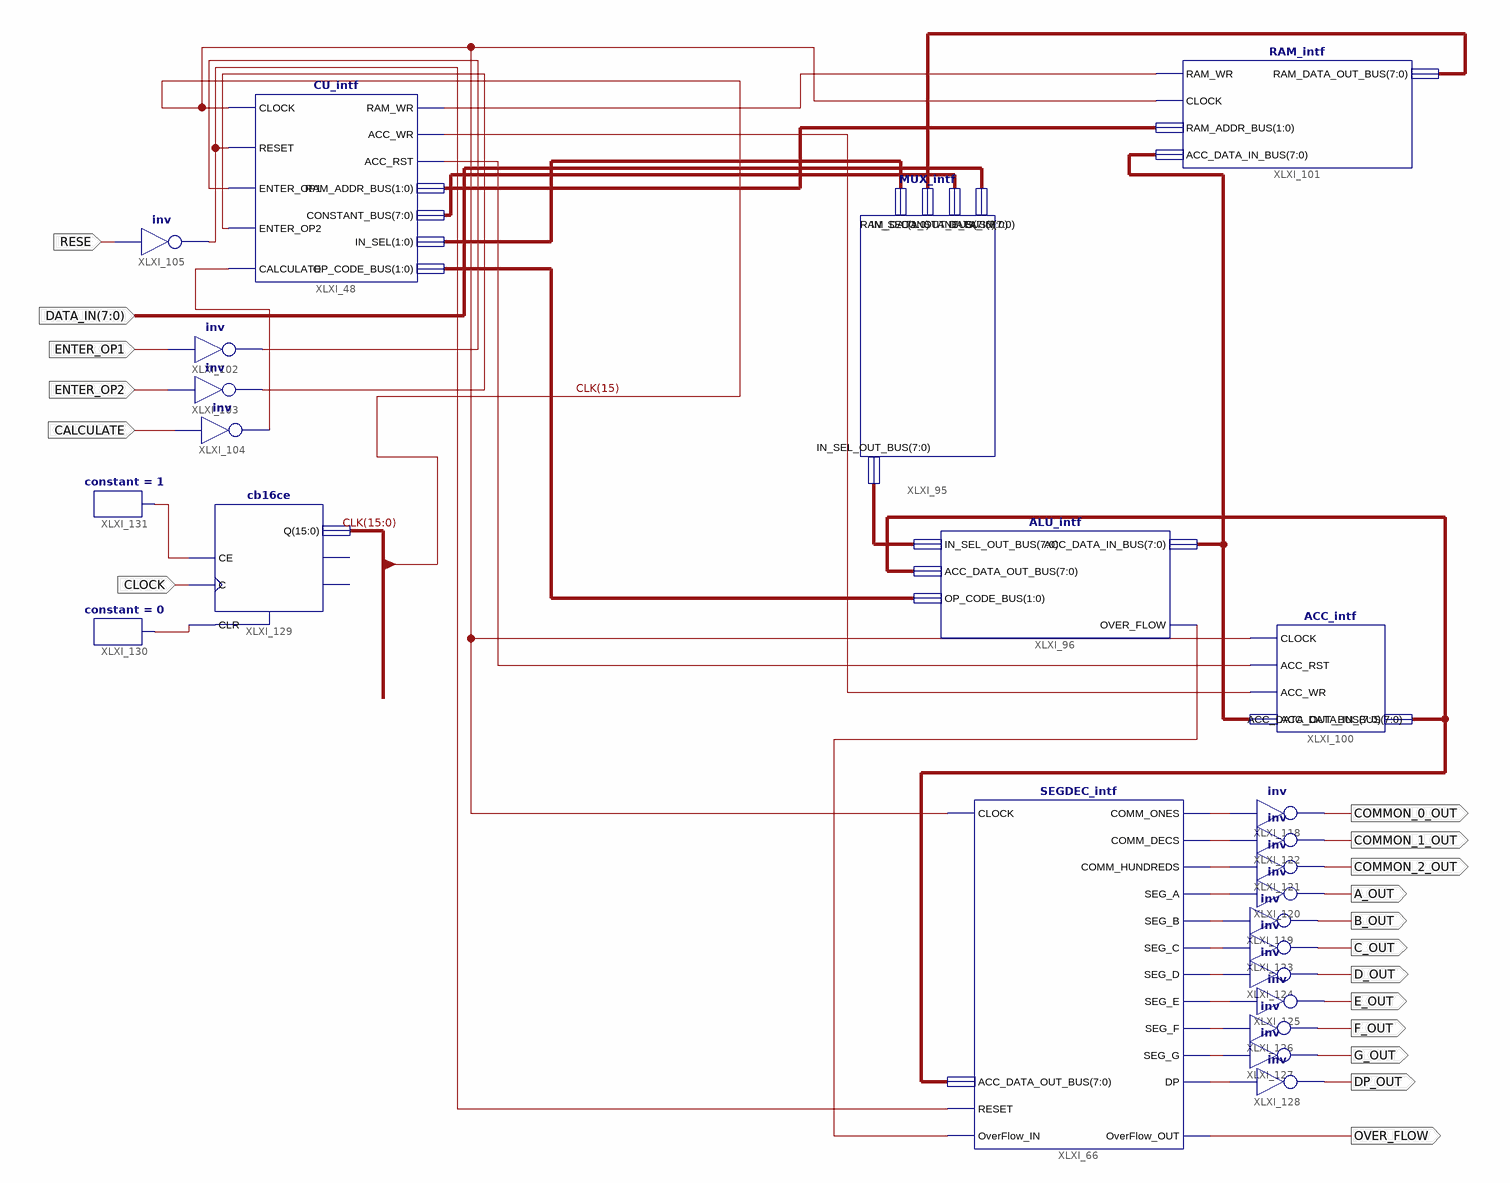
[diagram p0: schematic sheet 1]
// Xilinx ISE schematic TopLevel.sch (spartan3a) as structural Verilog: 24 symbols, 18 ports
module TopLevel (
  input  [7:0] DATA_IN,
  input  ENTER_OP1,
  input  ENTER_OP2,
  input  CALCULATE,
  input  RESE,
  input  CLOCK,
  output COMMON_0_OUT,
  output COMMON_1_OUT,
  output A_OUT,
  output B_OUT,
  output C_OUT,
  output D_OUT,
  output E_OUT,
  output F_OUT,
  output G_OUT,
  output DP_OUT,
  output OVER_FLOW,
  output COMMON_2_OUT
);

  wire RES, XLXN_223, XLXN_242, XLXN_243, XLXN_250, XLXN_254, XLXN_255, XLXN_256, XLXN_272, XLXN_273,
       XLXN_274, XLXN_275, XLXN_276, XLXN_277, XLXN_278, XLXN_279, XLXN_280, XLXN_281, XLXN_282, XLXN_287,
       XLXN_288;
  wire [1:0] XLXN_224, XLXN_234, XLXN_235;
  wire [7:0] XLXN_213, XLXN_240, XLXN_246, XLXN_248, XLXN_249;
  wire [15:0] CLK;

  CU_intf XLXI_48 (
    .CLOCK(CLK[15]), .RESET(RES), .ENTER_OP1(XLXN_254), .ENTER_OP2(XLXN_255), .CALCULATE(XLXN_256),
    .RAM_WR(XLXN_223), .ACC_WR(XLXN_242), .ACC_RST(XLXN_243), .RAM_ADDR_BUS(XLXN_224),
    .CONSTANT_BUS(XLXN_240), .IN_SEL(XLXN_234), .OP_CODE_BUS(XLXN_235));
  SEGDEC_intf XLXI_66 (
    .CLOCK(CLK[15]), .RESET(RES), .OverFlow_IN(XLXN_250), .ACC_DATA_OUT_BUS(XLXN_246), .COMM_ONES(XLXN_272),
    .COMM_DECS(XLXN_273), .COMM_HUNDREDS(XLXN_274), .SEG_A(XLXN_275), .SEG_B(XLXN_276), .SEG_C(XLXN_277),
    .SEG_D(XLXN_278), .SEG_E(XLXN_279), .SEG_F(XLXN_280), .SEG_G(XLXN_281), .DP(XLXN_282),
    .OverFlow_OUT(OVER_FLOW));
  MUX_intf XLXI_95 (
    .DATA_IN(DATA_IN), .CONSTANT_BUS(XLXN_240), .RAM_DATA_OUT_BUS(XLXN_249), .IN_SEL(XLXN_234),
    .IN_SEL_OUT_BUS(XLXN_213));
  ALU_intf XLXI_96 (
    .IN_SEL_OUT_BUS(XLXN_213), .ACC_DATA_OUT_BUS(XLXN_246), .OP_CODE_BUS(XLXN_235), .OVER_FLOW(XLXN_250),
    .ACC_DATA_IN_BUS(XLXN_248));
  ACC_intf XLXI_100 (
    .CLOCK(CLK[15]), .ACC_RST(XLXN_243), .ACC_WR(XLXN_242), .ACC_DATA_IN_BUS(XLXN_248),
    .ACC_DATA_OUT_BUS(XLXN_246));
  RAM_intf XLXI_101 (
    .RAM_WR(XLXN_223), .CLOCK(CLK[15]), .RAM_ADDR_BUS(XLXN_224), .ACC_DATA_IN_BUS(XLXN_248),
    .RAM_DATA_OUT_BUS(XLXN_249));
  not XLXI_102 (XLXN_254, ENTER_OP1);
  not XLXI_103 (XLXN_255, ENTER_OP2);
  not XLXI_104 (XLXN_256, CALCULATE);
  not XLXI_105 (RES, RESE);
  not XLXI_118 (COMMON_0_OUT, XLXN_272);
  not XLXI_119 (B_OUT, XLXN_276);
  not XLXI_120 (A_OUT, XLXN_275);
  not XLXI_121 (COMMON_2_OUT, XLXN_274);
  not XLXI_122 (COMMON_1_OUT, XLXN_273);
  not XLXI_123 (C_OUT, XLXN_277);
  not XLXI_124 (D_OUT, XLXN_278);
  not XLXI_125 (E_OUT, XLXN_279);
  not XLXI_126 (F_OUT, XLXN_280);
  not XLXI_127 (G_OUT, XLXN_281);
  not XLXI_128 (DP_OUT, XLXN_282);
  cb16ce XLXI_129 (.C(CLOCK), .CE(XLXN_287), .CLR(XLXN_288), .Q(CLK));  // open: CEO, TC
  constant #(.CValue("0")) XLXI_130 (.O(XLXN_288));
  constant #(.CValue("1")) XLXI_131 (.O(XLXN_287));
endmodule
